# Altium schematic sheet LPEDT_revA1_bikeit_POWER_MECH.SchDoc: Power Input Mechanical
size A; Author: Madhukar Arora; DocumentNumber: 3; Revision: 1; SheetNumber: 3; SheetTotal: 12
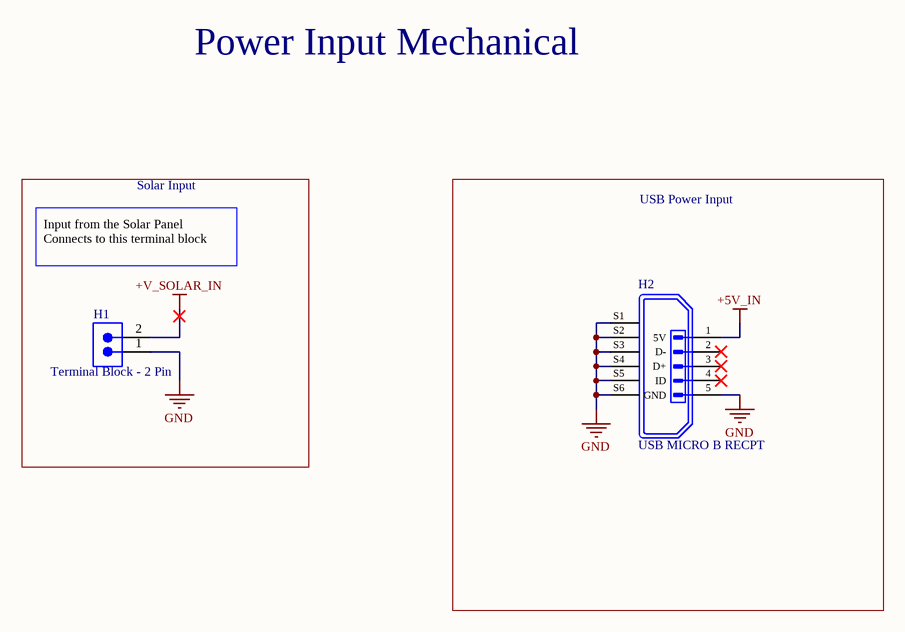
[diagram p0: LPEDT_revA1_bikeit_POWER_MECH.SchDoc]

## Parts
H1  Terminal Block - 2 Pin
H2  USB MICRO B RECPT  [AMPHENOL_10118194-0001LF]

## Blocks framed on the sheet
Solar Input: H1
USB Power Input: H2

## Nets
+5V_IN: H2.1(5V)
+V_SOLAR_IN: H1.2(+)
GND: H1.1(-) H2.5(GND) H2.S1 H2.S2 H2.S3 H2.S4 H2.S5 H2.S6

Not connected (* = marked no-connect by the designer): H2 2(D-)* 3(D+)* 4(ID)*

## Notes on the sheet
- Power Input Mechanical
- Input from the Solar Panel Connects to this terminal block
  Expected voltage range
  0V in darkness
  5V in direct sunlight

## Library data of the parts
H1 = 282834-2: TE CONNECTIVITY / BUCHANAN - 282834-2 - TERMINAL BLOCK, WIRE TO BRD, 2POS, 16AWG; Plating: Brass,Steel; Max Voltage Rating (AC): 150V; Number of Poles: 2; Gender: Male; Current Rating: 10A; Number of Levels: 1; Connector Type: Receptacle; Closed End: No (Without); Screwless Terminal Block: Yes (With); Wire Gauge (Max): 30AWG; Pitch: 2.54mm; Thread Size: M1.6; Tail Length: 3.4mm; Approvals: UL; Supplier 1: Digi-Key; Manufacturer: TE Connectivity; Manufacturer Part Number: 282834-2; RoHS: Yes; Category: Terminal Blocks; Stock 1: 20643; Pricing 1: 1=1.27000, 10=0.89500, 25=0.83440, 50=0.75740, 100=0.75410, 250=0.63676, 500=0.60324, 1000=0.53622, 5000=0.50270 (USD); Mount: Through Hole; Contact Plating: Tin; Contact Material: Brass; Color: Green; Material: Nylon; Housing Color: Green; Housing Material: Polyamide; Min Operating Temperature: -40°C; Max Operating Temperature: 105°C; Number of Rows: 1; Voltage Rating: 150V; Package Quantity: 300; Packaging: Bulk; Number of Positions: 2; Termination: Solder; Number of Positions Per Level: 2; Current: 10A; Voltage: 150V; Max Supply Voltage (AC): 150V; Number of Contacts: 2; Number of Circuits: 2; Orientation: Straight; Max Current Rating: 10A; Interlock: No (Without); Screw Flange: No (Without); Side Stackable: Yes (With); Series: Buchanan; Length: 5.54mm; Width: 6.5mm; Wire Gauge (Min): 30AWG; Wire/Cable Gauge: 30AWG; Depth: 6.5mm; Radiation Hardening: No; REACH SVHC: Unknown; ELV: Compliant; Lead Free: Lead Free; Flammability Rating: UL94 V-0; RoHS Compliant: Yes; ComponentLink1URL: https://datasheet.ciiva.com/11758/0900766b80e7dc96-11758675.pdf?src-supplier=RSComponents; ComponentLink1Description: https://datasheet.ciiva.com/11758/0900766b80e7dc96-11758675.pdf?src-supplier=RSComponents; ComponentLink2URL: https://datasheet.ciiva.com/16386/282834-2-16386363.pdf?src-supplier=Future+Electronics; ComponentLink2Description: https://datasheet.ciiva.com/16386/282834-2-16386363.pdf?src-supplier=Future+Electronics; ComponentLink3URL: https://datasheet.ciiva.com/14609/70086732-14609670.pdf?src-supplier=Allied+Electronics; ComponentLink3Description: https://datasheet.ciiva.com/14609/70086732-14609670.pdf?src-supplier=Allied+Electronics; ComponentLink4URL: https://datasheet.ciiva.com/15169/getdatasheetpartid-155864-15169558.pdf?src-supplier=Verical; ComponentLink4Description: https://datasheet.ciiva.com/15169/getdatasheetpartid-155864-15169558.pdf?src-supplier=Verical; ComponentLink5URL: https://datasheet.ciiva.com/16676/eng-cs-1308389-eurostyle-terminal-blocks-0607-16676126.pdf?src-supplier=Avnet+Europe; ComponentLink5Description: https://datasheet.ciiva.com/16676/eng-cs-1308389-eurostyle-terminal-blocks-0607-16676126.pdf?src-supplier=Avnet+Europe; ComponentLink6URL: https://datasheet.ciiva.com/30166/eng-cs-1308389-eurostyle-terminal-blocks-0607-30166974.pdf?src-supplier=Onlinecomponents.com; ComponentLink6Description: https://datasheet.ciiva.com/30166/eng-cs-1308389-eurostyle-terminal-blocks-0607-30166974.pdf?src-supplier=Onlinecomponents.com; ComponentLink7URL: https://datasheet.ciiva.com/3141/eng-cs-1308389-eurostyle-terminal-blocks-0607-3141115.pdf?src-supplier=Avnet; ComponentLink7Description: https://datasheet.ciiva.com/3141/eng-cs-1308389-eurostyle-terminal-blocks-0607-3141115.pdf?src-supplier=Avnet; ComponentLink8URL: https://datasheet.ciiva.com/823/eng-cd-282834-c1-823453.pdf?src-supplier=Digi-Key; ComponentLink8Description: https://datasheet.ciiva.com/823/eng-cd-282834-c1-823453.pdf?src-supplier=Digi-Key; Supplier Part Number 1: A98333-ND
H2 = 10118194-0001LF: USB - micro B USB 2.0 Receptacle Connector 5 Position Surface Mount, Right Angle; Through Hole; Manufacturer: Amphenol FCI; Number of Terminals/Pins: 5; Current Rating: 1.8A; Connector Type: USB,Receptacle; Insulation Resistance: 1GR; Number of Ports: 1; Max Voltage Rating (AC): 100V; Pitch: 0.65mm; Supplier 1: Digi-Key; Manufacturer Part Number: 10118194-0001LF; RoHS: Yes; Category: USB Connectors; Stock 1: 87961; Pricing 1: 1=0.48000, 10=0.45100, 25=0.38680, 50=0.32860, 100=0.31580, 250=0.28360, 500=0.27070 (USD); Mount: Surface Mount,Horizontal; Contact Material: Copper Alloy; Contact Plating: Gold; Housing Material: Polymer; Color: Black; Min Operating Temperature: -55°C; Max Operating Temperature: 85°C; Package Quantity: 9600; Packaging: Tape and Reel; Gender: Receptacle; Number of Contacts: 5; Termination: Solder; Orientation: Right Angle; Features: Shielded; Length: 8.05mm; Depth: 5mm; Radiation Hardening: No; Lead Free: Lead Free; Flammability Rating: UL94 V-0; ComponentLink1URL: https://datasheet.ciiva.com/4598/10118194ac-197217-4598807.pdf?src-supplier=Mouser; ComponentLink1Description: https://datasheet.ciiva.com/4598/10118194ac-197217-4598807.pdf?src-supplier=Mouser; ComponentLink2URL: https://datasheet.ciiva.com/26945/getdatasheetpartid-418619-26945695.pdf?src-supplier=Verical; ComponentLink2Description: https://datasheet.ciiva.com/26945/getdatasheetpartid-418619-26945695.pdf?src-supplier=Verical; ComponentLink3URL: https://datasheet.ciiva.com/851/10118194-851110.pdf?src-supplier=Digi-Key; ComponentLink3Description: https://datasheet.ciiva.com/851/10118194-851110.pdf?src-supplier=Digi-Key; ComponentLink4URL: https://datasheet.ciiva.com/851/10118194-851111.pdf?src-supplier=Digi-Key; ComponentLink4Description: https://datasheet.ciiva.com/851/10118194-851111.pdf?src-supplier=Digi-Key; Supplier Part Number 1: 609-4618-6-ND